# EasyEDA Pro project ProProject_Driver_STM32F031_2023-10-07.epro, board PCB1_1
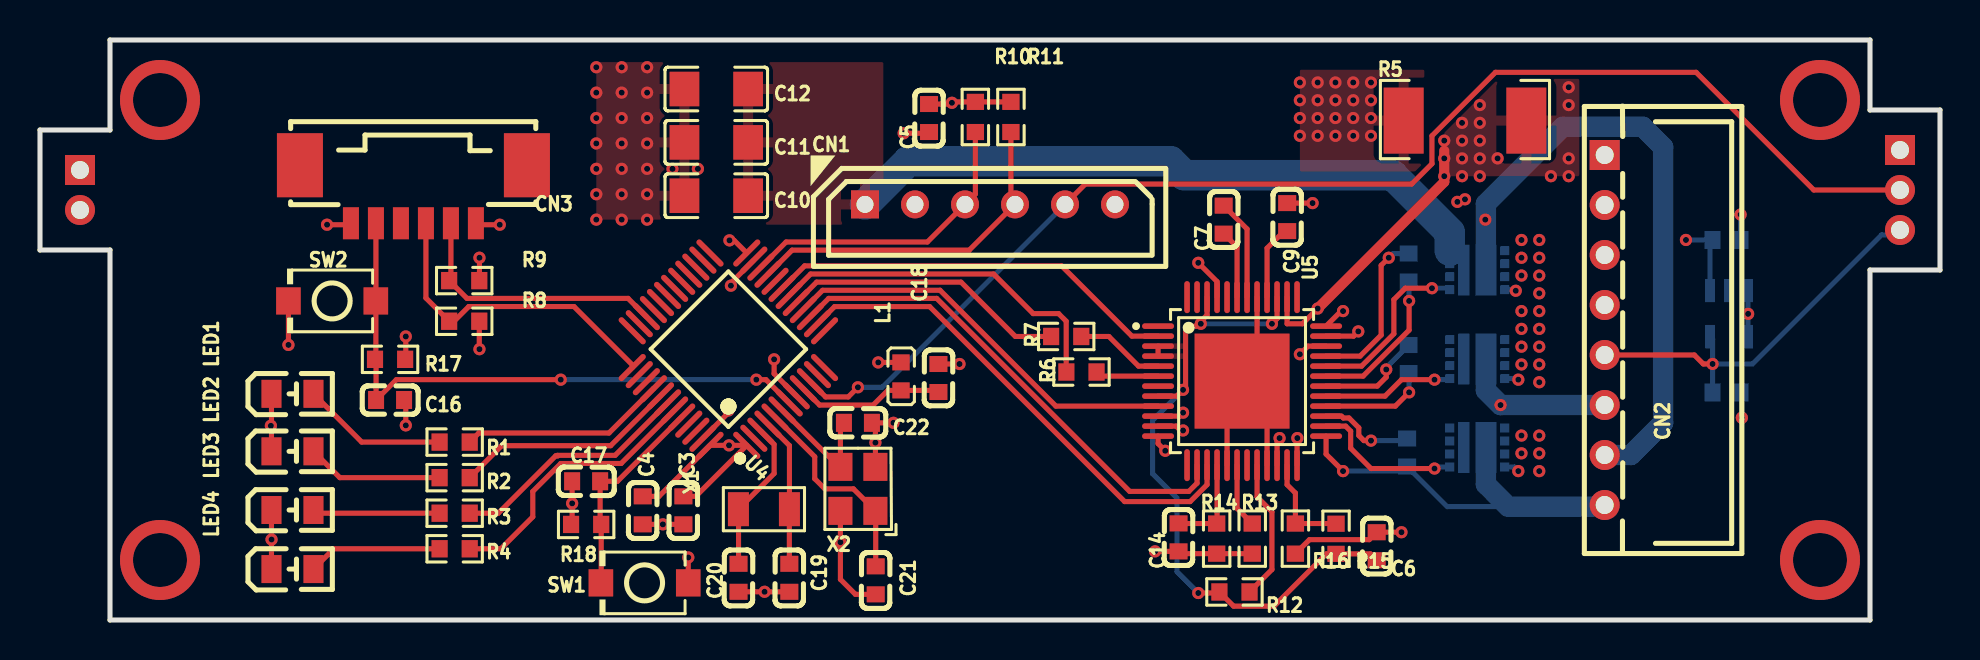
[diagram p6: board, top side]
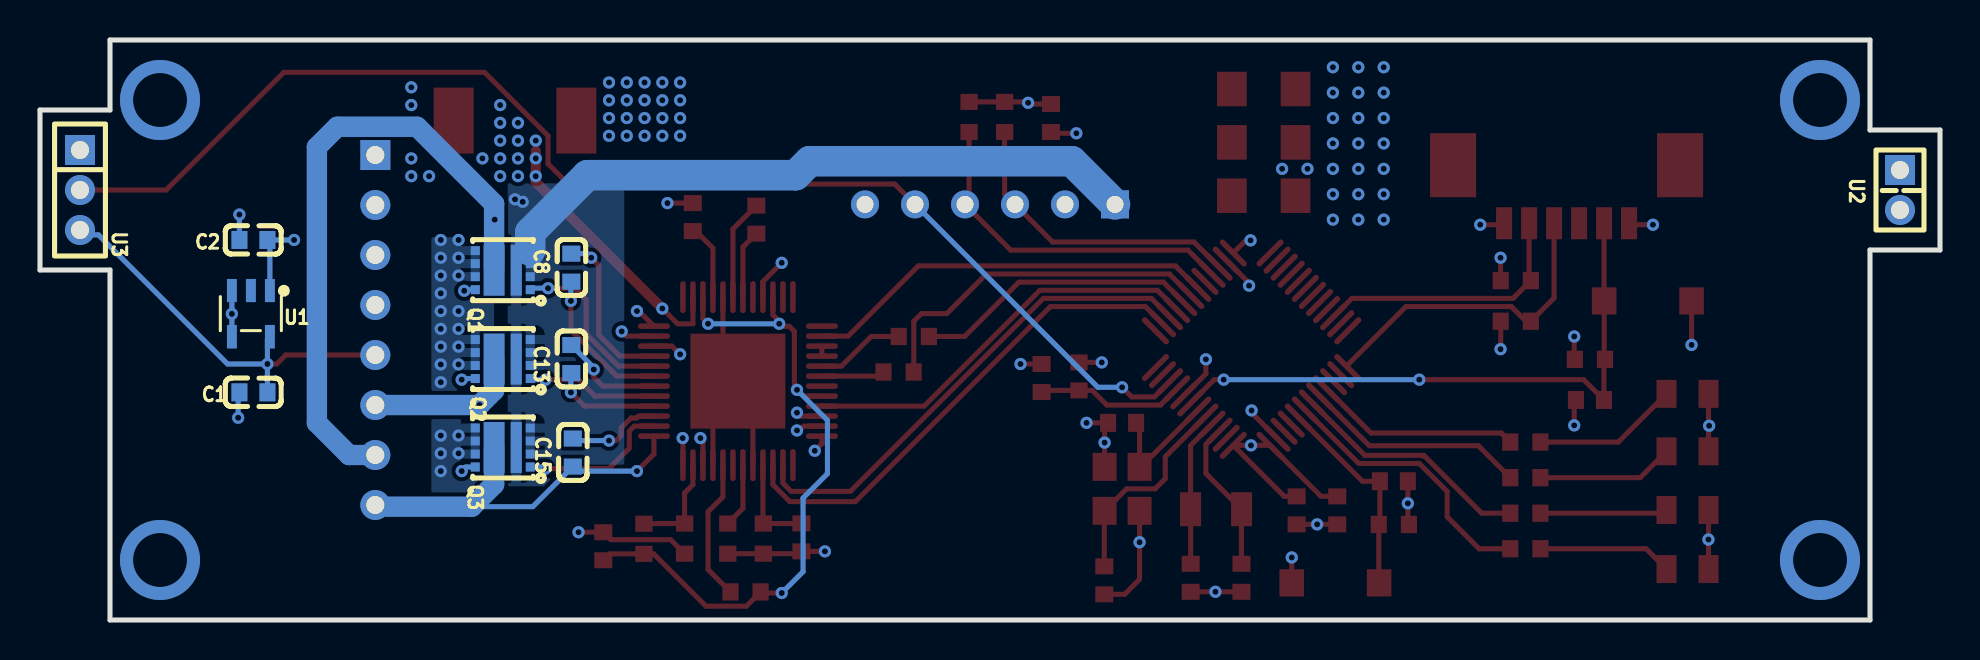
[diagram p7: board, bottom side, seen from below]

Outline 95 x 29 mm; copper layers: Top Layer, Inner1, Inner2, Bottom Layer. Coordinates in mm from the lower left corner of the outline.
Outline path: 0,24.5 0,18.5 3.5,18.5 3.5,0 91.5,0 91.5,17.5 95,17.5 95,25.5 91.5,25.5 91.5,29 3.5,29 3.5,24.5 0,24.5
Stack: Top Layer 0.035mm / Dielectric1 0.48mm PP er 4.5 / Inner1 0.035mm / Dielectric2 0.48mm FR4 er 4.5 / Inner2 0.035mm / Dielectric3 0.48mm PP er 4.5 / Bottom Layer 0.035mm

## Design rules (mm)
spacing safeClearance (default): track to track 0.152, other pairs 0.152 to 0.3
track width trackWidth (default): min 0.127, default 0.254, max 2.54
differential pair differentialPair (default): width min 0.127, default 0.254, max 2.54; gap min 0.152, default 0.152
via viaSize (default): diameter min 0.5, default 0.61, max 10; hole min 0.3, default 0.305, max 6
net GND uses copperRegion1
net VCC uses copperRegion1
net $1N6958 uses copperRegion1
net GND_CS uses copperRegion1
net +16V uses copperRegion1

## Placement (name value [footprint] x y rotation side)
C1  4.7uF  [C0603]  84.33 11.38 180 bottom
C2  10uF  [C0603]  84.33 19 180 bottom
C3  100nF  [C0603]  32.17 5.48 90 top
C4  100nF  [C0603]  30.14 5.48 90 top
C5  100nF  [C0603]  44.45 25.1 90 top
C6  1uF  [C0603]  66.83 3.69 270 top
C7  470nF  [C0603]  59.18 20.02 270 top
C8  33nF  [C0603]  68.43 17.62 270 bottom
C9  1uF  [C0603]  62.36 20.14 90 top
C10  10uF  [C1206]  33.81 21.21 0 top
C11  10uF  [C1206]  33.81 23.88 0 top
C12  10uF  [C1206]  33.81 26.55 0 top
C13  33nF  [C0603]  68.43 13.05 270 bottom
C14  1nF  [C0603]  56.93 4.13 90 top
C15  33nF  [C0603]  68.36 8.37 270 bottom
C16  100nF  [C0603]  17.5 11 180 top
C17  100nF  [C0603]  27.31 6.94 180 top
C18  100nF  [C0603]  44.92 12.1 270 top
C19  22pF  [c0603]  37.47 2.11 90 top
C20  22pF  [C0603]  34.93 2.11 90 top
C21  20pF  [c0603]  41.78 1.98 90 top
C22  20pF  [C0603]  40.9 9.86 0 top
CN1  HC-5264-6A  [CONN-TH_6P-P2.50_HCTL_HC-5264-6A]  47.5 20.78 0 top
CN2  HC-5264-8AW  [CONN-TH_8P-P2.50_HC-5264-8AW]  78.23 14.5 90 top
CN3  532610671  [CONN-SMD_6P-P1.25_53261-0671]  18.67 21.29 180 top
L1  3.3uH  [L0603]  43.05 12.18 270 top
LED1  SZYY0805B  [LED0805-R-RD_BLUE]  12.62 11.31 0 top
LED2  SZYY0805B  [LED0805-R-RD_BLUE]  12.62 8.43 0 top
LED3  SZYY0805B  [LED0805-R-RD_BLUE]  12.62 5.5 0 top
LED4  SZYY0805B  [LED0805-R-RD_BLUE]  12.62 2.55 0 top
Q1  DMT3009LDT-7  [V-DFN3030-8K_L3.0-W3.0-P0.65-BL]  71.86 17.49 90 bottom
Q2  DMT3009LDT-7  [V-DFN3030-8K_L3.0-W3.0-P0.65-BL]  71.86 13.05 90 bottom
Q3  DMT3009LDT-7  [V-DFN3030-8K_L3.0-W3.0-P0.65-BL]  71.86 8.62 90 bottom
R1  1kΩ  [R0603]  20.73 8.9 0 top
R2  1kΩ  [R0603]  20.73 7.12 0 top
R3  1kΩ  [R0603]  20.73 5.34 0 top
R4  1kΩ  [R0603]  20.73 3.56 0 top
R5  25mΩ  [RES-SMD_L6.4-W3.2-R2512]  71.25 24.97 0 top
R6  1kΩ  [R0603]  52.07 12.4 0 top
R7  1kΩ  [R0603]  51.31 14.18 0 top
R8  10kΩ  [R0603]  21.21 14.94 180 top
R9  10kΩ  [R0603]  21.21 16.97 180 top
R10  1kΩ  [R0603]  46.77 25.15 270 top
R11  1kΩ  [R0603]  48.55 25.15 270 top
R12  47kΩ  [R0603]  58.83 4.07 90 top
R13  10kΩ  [R0603]  60.61 4.07 270 top
R14  100kΩ  [R0603]  59.72 1.4 0 top
R15  100kΩ  [R0603]  64.8 4.06 90 top
R16  10kΩ  [R0603]  62.77 4.07 90 top
R17  10kΩ  [R0603]  17.5 13.03 0 top
R18  10kΩ  [R0603]  27.31 4.78 180 top
SW1  TS-1088-AR02016  [SW-SMD_L3.9-W3.0-P4.45]  30.23 1.86 180 top
SW2  TS-1088-AR02016  [SW-SMD_L3.9-W3.0-P4.45]  14.61 15.95 180 top
U1  TPS7B6950DBVR  [SOT-23-5_L3.0-W1.7-P0.95-LS2.8-BL]  84.46 15.32 0 bottom
U2  DW200R-11-02-43  [HDR-TH_2P-P2.00-V-F]  2 21.5 270 bottom
U3  PM200-1-03-Z-4.3  [HDR-TH_3P-P2.00-V-F-A]  93 21.5 270 bottom
U4  STM32F031C6T6TR  [LQFP-48_L7.0-W7.0-P0.50-LS9.0-TL]  34.42 13.54 135 top
U5  A3930KJPTR-T  [LQFP-48_L7.0-W7.0-P0.50-LS9.0-BL-EP]  60.1 11.94 270 top
X1  32.768kHz  [CRYSTAL-SMD_L3.2-W1.5-1]  36.2 5.54 180 top
X2  8MHz  [OSC-SMD_4P-L3.2-W2.5-BL]  40.9 6.56 90 top

## Footprints (pads in the part's own frame, mm; a bottom-side part is the same pattern mirrored in y, then rotated)
C0603
  rect 0.8x0.9 smd: 1(-0.7,0) 2(0.7,0)
c0603
  rect 0.8x0.9 smd: 1(-0.7,0) 2(0.7,0)
C1206
  rect 1.485x1.728 smd: 1(-1.593,0) 2(1.593,0)
CONN-SMD_6P-P1.25_53261-0671
  rect 0.8x1.6 smd: 1(3.124,1.45) 2(1.875,1.45) 3(0.625,1.45) 4(-0.625,1.45) 5(-1.875,1.45) 6(-3.124,1.45)
  rect 2.301x3.2 smd: 7(-5.675,-1.45) 8(5.675,-1.45)
CONN-TH_6P-P2.50_HCTL_HC-5264-6A
  rect 1.4x1.4 hole 0.85: 1(-6.25,0)
  round 1.4 hole 0.85: 2(-3.75,0) 3(-1.25,0) 4(1.25,0) 5(3.75,0) 6(6.25,0)
CONN-TH_8P-P2.50_HC-5264-8AW
  rect 1.5x1.5 hole 0.9: 1(8.75,0)
  round 1.5 hole 0.9: 2(6.25,0) 3(3.75,0) 4(1.25,0) 5(-1.25,0) 6(-3.75,0) 7(-6.25,0) 8(-8.75,0)
CRYSTAL-SMD_L3.2-W1.5-1
  rect 1.05x1.7 smd: 1(-1.275,0) 2(1.275,0)
HDR-TH_2P-P2.00-V-F
  rect 1.5x1.5 hole 0.9: 1(-1,0)
  round 1.5 hole 0.9: 2(1,0)
HDR-TH_3P-P2.00-V-F-A
  rect 1.5x1.5 hole 0.9: 1(-2,0)
  round 1.5 hole 0.9: 2(0,0) 3(2,0)
L0603
  rect 0.8x0.864 smd: 1(-0.7,0) 2(0.7,0)
LED0805-R-RD_BLUE
  rect 1.001x1.399 smd: 1(1.052,0) 2(-1.049,0)
LQFP-48_L7.0-W7.0-P0.50-LS9.0-BL-EP
  oval 0.28x1.6 smd: 1(-2.75,-4.2) 2(-2.25,-4.2) 3(-1.75,-4.2) 4(-1.25,-4.2) 5(-0.75,-4.2) 6(-0.25,-4.2) 7(0.25,-4.2) 8(0.75,-4.2) 9(1.25,-4.2) 10(1.75,-4.2) 11(2.25,-4.2) 12(2.75,-4.2) 25(2.75,4.2) 26(2.25,4.2) 27(1.75,4.2) 28(1.25,4.2) 29(0.75,4.2) 30(0.25,4.2) 31(-0.25,4.2) 32(-0.75,4.2) 33(-1.25,4.2) 34(-1.75,4.2) 35(-2.25,4.2) 36(-2.75,4.2)
  oval 1.6x0.28 smd: 13(4.2,-2.75) 14(4.2,-2.25) 15(4.2,-1.75) 16(4.2,-1.25) 17(4.2,-0.75) 18(4.2,-0.25) 19(4.2,0.25) 20(4.2,0.75) 21(4.2,1.25) 22(4.2,1.75) 23(4.2,2.25) 24(4.2,2.75) 37(-4.2,2.75) 38(-4.2,2.25) 39(-4.2,1.75) 40(-4.2,1.25) 41(-4.2,0.75) 42(-4.2,0.25) 43(-4.2,-0.25) 44(-4.2,-0.75) 45(-4.2,-1.25) 46(-4.2,-1.75) 47(-4.2,-2.25) 48(-4.2,-2.75)
  rect 4.75x4.75 smd: 49(0,0)
LQFP-48_L7.0-W7.0-P0.50-LS9.0-TL
  oval 1.8x0.28 smd: 1(-4.05,2.75) 2(-4.05,2.25) 3(-4.05,1.75) 4(-4.05,1.25) 5(-4.05,0.75) 6(-4.05,0.25) 7(-4.05,-0.25) 8(-4.05,-0.75) 9(-4.05,-1.25) 10(-4.05,-1.75) 11(-4.05,-2.25) 12(-4.05,-2.75) 25(4.05,-2.75) 26(4.05,-2.25) 27(4.05,-1.75) 28(4.05,-1.25) 29(4.05,-0.75) 30(4.05,-0.25) 31(4.05,0.25) 32(4.05,0.75) 33(4.05,1.25) 34(4.05,1.75) 35(4.05,2.25) 36(4.05,2.75)
  oval 0.28x1.8 smd: 13(-2.75,-4.05) 14(-2.25,-4.05) 15(-1.75,-4.05) 16(-1.25,-4.05) 17(-0.75,-4.05) 18(-0.25,-4.05) 19(0.25,-4.05) 20(0.75,-4.05) 21(1.25,-4.05) 22(1.75,-4.05) 23(2.25,-4.05) 24(2.75,-4.05) 37(2.75,4.05) 38(2.25,4.05) 39(1.75,4.05) 40(1.25,4.05) 41(0.75,4.05) 42(0.25,4.05) 43(-0.25,4.05) 44(-0.75,4.05) 45(-1.25,4.05) 46(-1.75,4.05) 47(-2.25,4.05) 48(-2.75,4.05)
OSC-SMD_4P-L3.2-W2.5-BL
  rect 1.4x1.2 smd: 1(-1.1,-0.875) 2(1.1,-0.875) 3(1.1,0.875) 4(-1.1,0.875)
R0603
  rect 0.806x0.864 smd: 1(-0.753,0) 2(0.753,0)
RES-SMD_L6.4-W3.2-R2512
  rect 2x3.3 smd: 1(-3.067,0) 2(3.067,0)
SOT-23-5_L3.0-W1.7-P0.95-LS2.8-BL
  rect 0.49x1.157 smd: 1(-0.95,-1.153) 2(0,-1.153) 3(0.95,-1.153)
  rect 0.49x1.175 smd: 4(0.95,1.153) 5(-0.95,1.153)
SW-SMD_L3.9-W3.0-P4.45
  rect 1.23x1.36 smd: 1(-2.185,0) 2(2.185,0)
V-DFN3030-8K_L3.0-W3.0-P0.65-BL
  rect 0.45x0.45 smd: 1(-0.975,-1.375) 2(-0.325,-1.375) 3(0.325,-1.375) 4(0.975,-1.375) 5(0.975,1.375) 6(0.325,1.375) 7(-0.325,1.375) 8(-0.975,1.375)
  rect 2.55x1.044 smd: 9(0,0.433)
  rect 2.55x0.556 smd: 10(0,-0.672)

## Nets
As in the schematic.

Pads without a net: CN3 3 7 8; U1 2; U4 2 11 20 25 26 27 28 29 30 31 32 33 35 36 38 39 45 46; U5 1 7 13 19 37 44 47 48

## Via types
v1: diameter 4, hole 2.7, Top Layer to Bottom Layer, 4 vias
v2: diameter 0.61, hole 0.305, Top Layer to Bottom Layer, 148 vias

## Routing (per net, layer and track width the routed paths; a pad name or vN(x,y) marks a point on that pad's centre or on a via; arc(x,y) is an arc through that point)
+5V: length 20.6
  Top Layer w0.254: CN2.5 82.72,13.25 83.16,12.8 v2(83.63,12.8)
  Bottom Layer w0.254: U3.3 92.76,19.26 92.08,19.26 85.62,12.8 v2(83.63,12.8) ; v2(83.63,12.8) C1.2 ; v2(83.63,12.8) 83.63,14.04 U1.5
+16V: length 81.8
  Top Layer w0.254: U5.45 58.85,16.92 v2(57.91,17.86) ; v2(62.87,9.1) 62.85,9.08 U5.24
  Inner2 w0.254: v2(62.87,9.1) 61.34,10.62 61.34,13.41 58.93,15.83 58.93,16.84 v2(57.91,17.86) ; v2(71.25,21.03) 76.71,21.03 77.6,21.92 80.39,21.92 81.16,21.16 81.16,20.14 v2(82.3,19)
  Inner2 w0.508: v2(57.91,17.86) 44.17,17.86
  Inner2 w0.762: 44.17,17.86 CN1.1
  Bottom Layer w0.254: v2(82.3,19) C2.2 83.51,18.88 U1.1
  Bottom Layer w1.524: Q1.4 70.49,19.38 67.63,22.24 57.22,22.24 56.52,22.94 43.41,22.94 CN1.1
  vias: v2(70.87,20.91)
GND: length 64.3
  Top Layer w0.254: 60.6,12.44 60.85,12.69 U5.41 ; C3.1 v2(31.14,4.78) C4.1 ; 37.81,11.21 36.71,12.32 v2(36.71,13.03) ; R16.1 63.47,4.02 66.46,4.02 C6.1 v2(68.07,4.39) ; 60.6,11.44 61.35,10.69 U5.21 ; R8.1 21.96,13.55 v2(21.97,13.54) ; C18.1 v2(45.98,12.8) ; U4.23 34.55,16.85 v2(34.55,16.72) ; v2(43.18,24.34) 44.39,24.34 C5.1 ; X2.4 v2(40.02,3.89) 40.02,2.03 40.77,1.28 C21.1 ; 59.6,11.44 59.35,11.19 U5.17 ; C9.2 v2(63.63,20.84) ; v2(42.67,9.86) C22.2 41.77,9.68 v2(41.77,8.87) X2.2 ; R13.2 R12.1 57.04,3.32 C14.1 v2(55.75,3.43) ; LED2.2 LED1.2 ; R18.2 26.61,4.83 v2(26.61,5.83) C17.2 ; SW2.2 v2(12.42,13.75) ; LED3.2 LED4.2 ; v2(22.99,19.76) 21.87,19.76 CN3.6 ; C19.1 v2(36.23,1.41) C20.1 ; v2(18.29,9.73) 18.29,10.91 C16.1 ; v2(34.42,10.48) 34.42,10.36 U4.47
  Bottom Layer w0.254: 85.41,16.47 v2(85.41,15.31) 85.41,14.17 ; C1.1 85.09,11.32 v2(85.09,10.11) ; C2.1 v2(85.03,20.27)
  vias: v2(11.54,9.71) v2(11.58,4.02) v2(27.81,27.64) v2(27.81,26.37) v2(27.81,25.1) v2(27.81,23.83) v2(27.81,22.56) v2(27.81,21.29) v2(27.81,20.02) v2(29.09,27.64) v2(29.09,26.37) v2(29.09,25.1) v2(29.09,23.83) v2(29.09,22.56) v2(29.09,21.29) v2(29.09,20.02) v2(30.35,27.64) v2(30.35,26.37) v2(30.35,25.1) v2(30.35,23.83) v2(30.35,22.56) v2(30.35,21.29) v2(30.35,20.02) v2(31.62,22.56) v2(32.9,22.56) v2(62.99,26.88) v2(62.99,25.99) v2(62.99,25.1) v2(62.99,24.21) v2(63.88,26.88) v2(63.88,25.99) v2(63.88,25.1) v2(63.88,24.21) v2(64.77,26.88) v2(64.77,25.99) v2(64.77,25.1) v2(64.77,24.21) v2(65.66,26.88) v2(65.66,25.99) v2(65.66,25.1) v2(65.66,24.21) v2(66.55,26.88) v2(66.55,25.99) v2(66.55,25.1) v2(66.55,24.21)
GND_CS: length 22.4
  Top Layer w0.254: v2(63.88,15.57) 63.12,14.81 62.35,14.81 U5.38 ; v2(61.98,9.1) 61.85,8.97 U5.22
  Top Layer w0.508: 70.21,23.46 v2(70.21,23.08) 70.21,21.9 v2(63.88,15.57)
  Inner1 w0.254: v2(61.98,9.1) 62.23,9.35 62.23,13.92 v2(63.88,15.57)
  vias: v2(70.21,23.97) v2(70.21,22.19) v2(71.1,24.86) v2(71.1,23.97) v2(71.1,23.08) v2(71.1,22.19) v2(71.99,25.75) v2(71.99,24.86) v2(71.99,23.97) v2(71.99,23.08) v2(71.99,22.19) v2(72.88,23.08) v2(74.07,19) v2(74.07,18.11) v2(74.07,17.22) v2(74.07,15.44) v2(74.07,14.56) v2(74.07,13.67) v2(74.07,12.78) v2(74.07,9.22) v2(74.07,8.33) v2(74.96,19) v2(74.96,18.11) v2(74.96,17.22) v2(74.96,16.33) v2(74.96,15.44) v2(74.96,14.56) v2(74.96,13.67) v2(74.96,12.78) v2(74.96,11.89) v2(74.96,9.22) v2(74.96,8.33) v2(74.96,7.44) v2(75.55,22.19) v2(76.44,26.64) v2(76.44,25.75) v2(76.44,23.08) v2(76.44,22.19)
VCC: length 21.7
  Top Layer w0.254: U4.24 34.71,18.98 v2(34.47,18.98) ; C5.2 45.53,25.8 v2(45.59,25.86) 45.64,25.91 R10.1 R11.1 ; v2(21.97,18.11) 21.97,16.98 R9.1 ; CN3.1 15.47,19.76 v2(14.35,19.76) ; L1.1 v2(41.91,12.88) ; R17.2 18.29,13.07 v2(18.29,14.18) ; SW1.1 v2(32.41,3.13) ; C4.2 30.95,6.18 U4.48 v2(34.45,8.73) U4.1 32.79,6.18 C3.2
VDDA: length 7.4
  Top Layer w0.254: 38.17,11.56 38.98,10.75 41.66,10.75 42.39,11.48 L1.2 44.84,11.48 C18.2
(no net):
  vias: v1(6,26) v1(6,3) v1(89,26) v1(89,3)
32_IN: length 7.6
  Top Layer w0.254: C20.2 34.93,5.53 X1.2 36.71,7.32 36.71,8.78 U4.3
32_OUT: length 7.4
  Top Layer w0.254: 36.4,9.79 37.47,8.72 X1.1 37.47,5.53 C19.2
BOOT0: length 10.5
  Top Layer w0.254: 32.09,10.15 28.88,6.94 28.01,6.94 28.01,4.83 R18.1 28.06,1.87 SW1.2
CA: length 8.3
  Top Layer w0.254: v2(67.44,18.11) 67.06,17.73 67.06,14.25 66,13.19 U5.33
  Bottom Layer w0.254: C8.1 67.65,18.32 v2(67.44,18.11)
CB: length 5.3
  Top Layer w0.254: v2(67.31,12.53) 67.31,12.14 66.86,11.69 U5.30
  Bottom Layer w0.254: v2(67.31,12.53) 67.31,12.62 C13.1
CC: length 4.8
  Top Layer w0.254: v2(66.55,8.97) 66.19,8.97 65.94,9.22 65.94,9.61 65.45,10.1 65.16,10.1 65.07,10.19 U5.27
  Bottom Layer w0.254: v2(66.55,8.97) 68.26,8.97 C15.1
DIR: length 20.5
  Top Layer w0.254: U5.9 50.79,10.69 45,16.49 39.13,16.49 U4.16
FF1: length 17.8
  Top Layer w0.254: R6.1 51.31,12.41 51.31,14.94 50.93,15.32 49.66,15.32 47.68,17.3 38.53,17.3 U4.18
FF2: length 14.3
  Top Layer w0.254: 37.81,15.87 38.83,16.89 46.05,16.89 48.77,14.18 R7.1
GHA: length 8.8
  Top Layer w0.254: U5.32 66.08,12.69 67.69,14.31 67.69,16.02 68.26,16.59 v2(69.6,16.59)
  Bottom Layer w0.254: 70.49,16.52 70.42,16.59 v2(69.6,16.59)
GHB: length 6.5
  Top Layer w0.254: U5.29 67.25,11.19 68.07,12.02 v2(69.72,12.02)
  Bottom Layer w0.254: Q2.1 70.43,12.02 v2(69.72,12.02)
GHC: length 7.6
  Top Layer w0.254: v2(69.72,7.57) 66.55,7.57 65.53,8.59 65.53,9.44 65.28,9.69 U5.26
  Bottom Layer w0.254: Q3.1 69.8,7.65 v2(69.72,7.57)
GLA: length 11
  Top Layer w0.254: U5.36 65.06,15.45 v2(65.15,15.45)
  Inner1 w0.254: v2(73.79,16.46) 72.52,15.19 65.41,15.19 v2(65.15,15.45)
  Bottom Layer w0.254: v2(73.79,16.46) 73.73,16.52 73.24,16.52
GLB: length 11.4
  Top Layer w0.254: v2(65.91,14.43) 65.68,14.19 U5.35
  Inner1 w0.254: v2(65.91,14.43) 71.5,14.43 v2(73.92,12.02)
  Bottom Layer w0.254: v2(73.92,12.02) 73.86,12.07 Q2.8
GLC: length 15.6
  Top Layer w0.254: U5.34 63.4,13.69 v2(62.99,13.29)
  Inner1 w0.254: v2(62.99,13.29) 63.45,13.29 67.9,8.84 72.52,8.84 v2(73.92,7.44)
  Bottom Layer w0.254: v2(73.92,7.44) 73.71,7.65 Q3.8
HA: length 27.8
  Top Layer w0.254: v2(57.15,10.37) 56.98,10.19 U5.10
  Inner2 w0.254: CN2.4 78.16,15.75 76.58,14.18 76.58,12.02 74.93,10.37 74.17,10.37 72.65,8.84 69.34,8.84 68.58,8.08 61.6,8.08 59.31,10.37 v2(57.15,10.37)
HB: length 40.7
  Top Layer w0.254: U5.11 56.81,9.69 57.03,9.48 v2(57.15,9.48)
  Inner2 w0.254: CN2.3 80.27,16.22 80.27,5.73 78.68,4.14 70.11,4.14 68.84,5.41 61.22,5.41 v2(57.15,9.48)
HC: length 45.7
  Top Layer w0.254: v2(56.26,8.46) 55.9,8.82 U5.12
  Inner2 w0.254: CN2.2 81.92,17.07 81.92,6.81 78.23,3.13 61.6,3.13 v2(56.26,8.46)
I2C1_SCL: length 17.5
  Top Layer w0.254: R11.2 48.55,20.98 CN1.4 46.46,18.49 37.6,18.49 36.4,17.29
I2C1_SDA: length 15.3
  Top Layer w0.254: R10.2 46.77,21.3 CN1.3 44.37,18.9 37.3,18.9 U4.22
IR_SIGNAL: length 64.8
  Top Layer w0.254: v2(40.9,11.64) 40.41,11.15 39.28,11.15 U4.10 ; U3.2 88.69,21.5 82.81,27.38 72.77,27.38 69.6,24.21 69.6,22.81 68.58,21.8 52.27,21.8 CN1.5
  Bottom Layer w0.254: CN1.5 42.11,11.64 v2(40.9,11.64)
LED1: length 10.3
  Top Layer w0.254: R1.2 21.94,9.35 28.45,9.35 30.66,11.56 30.67,11.56
LED2: length 11.2
  Top Layer w0.254: R2.2 23.08,8.72 28.53,8.72 U4.41
LED3: length 12.2
  Top Layer w0.254: U4.42 28.76,8.23 25.87,8.23 25.9,8.21 25.78,8.21 22.92,5.34 R3.2
LED4: length 13.9
  Top Layer w0.254: R4.2 23.04,3.56 24.64,5.16 24.64,6.43 26.04,7.83 29.06,7.83 U4.43
MOTOR_MODE: length 25.2
  Top Layer w0.254: U5.15 58.35,6.77 57.51,5.92 54.23,5.92 44.48,15.67 39.73,15.67 U4.14
MOTOR_RESET: length 20.7
  Top Layer w0.254: U4.19 38.23,17.71 51.08,17.71 54.59,14.19 U5.2
NRST: length 30.4
  Top Layer w0.254: v2(35.82,12.02) 36.3,12.02 U4.7 ; v2(26.04,12.02) 17.82,12.02 C16.2 16.8,12.98 R17.1 16.79,13.08 SW2.1 16.8,15.96 CN3.2
  Bottom Layer w0.254: v2(26.04,12.02) v2(35.82,12.02)
OSC_IN: length 10.4
  Top Layer w0.254: C21.2 41.78,5.44 X2.1 40.67,6.56 39.25,6.56 38.74,7.06 38.74,8.16 36.75,10.15
OSC_OUT: length 6.4
  Top Layer w0.254: C22.1 40.02,9.68 X2.3 39.95,7.66 U4.6
PWM: length 24.8
  Top Layer w0.254: U5.14 57.85,6.84 57.44,6.43 54.49,6.43 44.83,16.08 39.43,16.08 U4.15
SWCLK: length 16.2
  Top Layer w0.254: U4.37 29.61,12.76 26.7,15.67 21.44,15.67 20.7,14.94 R8.2 19.3,16.1 CN3.4
SWDIO: length 13.5
  Top Layer w0.254: CN3.5 20.55,17.06 R9.2 21.35,16.08 29.4,16.08 U4.34
U: length 19.6
  Top Layer w0.254: v2(65.15,7.44) 64.3,8.29 U5.25
  Bottom Layer w0.254: v2(65.15,7.44) 68.13,7.44 C15.2 70.36,5.67 73.41,5.67
  Bottom Layer w1.016: CN2.8 78.15,5.67 73.41,5.67 72.3,6.78 Q3.9
V: length 46.2
  Top Layer w0.254: U5.31 66.15,12.19 68.46,14.49 v2(68.46,15.95)
  Inner2 w0.254: v2(68.46,15.95) 71,15.95 72.26,17.22 v2(72.26,20.02)
  Bottom Layer w0.254: v2(68.46,15.95) 68.46,16.9 C8.2
  Bottom Layer w1.016: CN2.7 79.55,8.25 81.16,9.86 81.16,23.64 80.14,24.66 76.15,24.66 72.3,20.81 Q1.9
W: length 18.1
  Top Layer w0.254: v2(68.46,11.38) 67.77,10.69 U5.28
  Inner2 w0.254: v2(68.46,11.38) 69.09,10.75 v2(73.03,10.75)
  Bottom Layer w0.254: v2(68.46,11.38) 68.46,12.33 C13.2
  Bottom Layer w1.016: 72.3,13.05 72.3,11.48 v2(73.03,10.75) 78.23,10.75 CN2.6
$1N6930: length 3.5
  Top Layer w0.254: U5.43 59.85,18.65 C7.2
$1N6936: length 3.8
  Top Layer w0.254: U5.40 61.35,18.59 62.32,19.56
$1N6937: length 5.1
  Top Layer w0.254: U5.42 60.35,19.55 C7.1
$1N6938: length 7.1
  Top Layer w0.254: R14.2 61.6,2.52 61.6,5.41 60.85,6.16 U5.20
$1N6939: length 4.8
  Top Layer w0.254: C14.2 56.94,4.82 R12.2 58.85,4.84 U5.16
$1N6940: length 5.1
  Top Layer w0.254: R15.2 64.79,4.82 R16.2 62.77,6.35 62.35,6.77 U5.23
$1N6942: length 3.2
  Top Layer w0.254: U5.18 59.85,5.58 R13.1
$1N6958: length 34.3
  Top Layer w0.254: v2(61.6,14.81) 61.85,15.07 U5.39 ; U5.3 U5.4 ; U5.46 58.35,15.25 57.79,14.68 57.53,14.68 57.28,14.43 57.28,11.64 56.84,11.19 U5.8 ; C6.2 66.52,3.31 R15.1 64.32,3.31 61.7,0.69 59.68,0.69 58.97,1.4 58.92,1.35 v2(57.91,1.35)
  Bottom Layer w0.254: v2(57.15,11.51) 55.63,9.98 55.63,7.32 56.85,6.1 56.85,2.42 v2(57.91,1.35) ; v2(61.6,14.81) v2(58.04,14.81)
$1N6995: length 7.3
  Top Layer w0.254: LED1.1 16.09,8.9 R1.1
$1N6998: length 6.9
  Top Layer w0.254: R2.1 14.99,7.12 LED2.1
$1N7001: length 6.4
  Top Layer w0.254: R3.1 13.83,5.34 LED3.1
$1N7004: length 6.7
  Top Layer w0.254: LED4.1 14.69,3.56 R4.1
$1N51447: length 3.2
  Top Layer w0.254: R6.2 53.03,12.19 U5.6
$1N51449: length 4.5
  Top Layer w0.254: R7.2 53.44,14.18 54.93,12.69 U5.5

## Copper pours and planes (outline as drawn; the poured copper is in the pictures)
+16V on Top Layer: 34.55,27.89 42.17,27.89 42.17,19.76 34.55,19.76
+16V on Bottom Layer: 65.79,21.83 71.62,21.83 71.62,6.68 65.79,6.68
GND on Top Layer: 27.81,27.89 33.15,27.89 33.15,20.02 27.81,20.02
GND on Top Layer: 62.99,27.51 69.22,27.51 69.22,22.43 62.99,22.43
GND on Inner1: -1.65,32.97 95.51,32.97 95.51,-1.83 -1.65,-1.83
GND_CS on Top Layer: 70.21,28.15 76.96,28.15 76.96,22.19 70.21,22.19
GND_CS on Bottom Layer: 72.3,19.14 75.43,19.14 75.43,5.67 72.3,5.67
GND_CS on Inner1: 70.11,28.27 77.22,28.27 77.22,6.3 70.11,6.3
VCC on Inner2: -5.71,31.96 97.92,31.96 97.92,-0.56 -5.71,-0.56
$1N6958 on Top Layer: 54.99,13.92 57.41,13.92 57.41,12.91 54.99,12.91
